# EAGLE design range_tag (EAGLE 8.2.2)
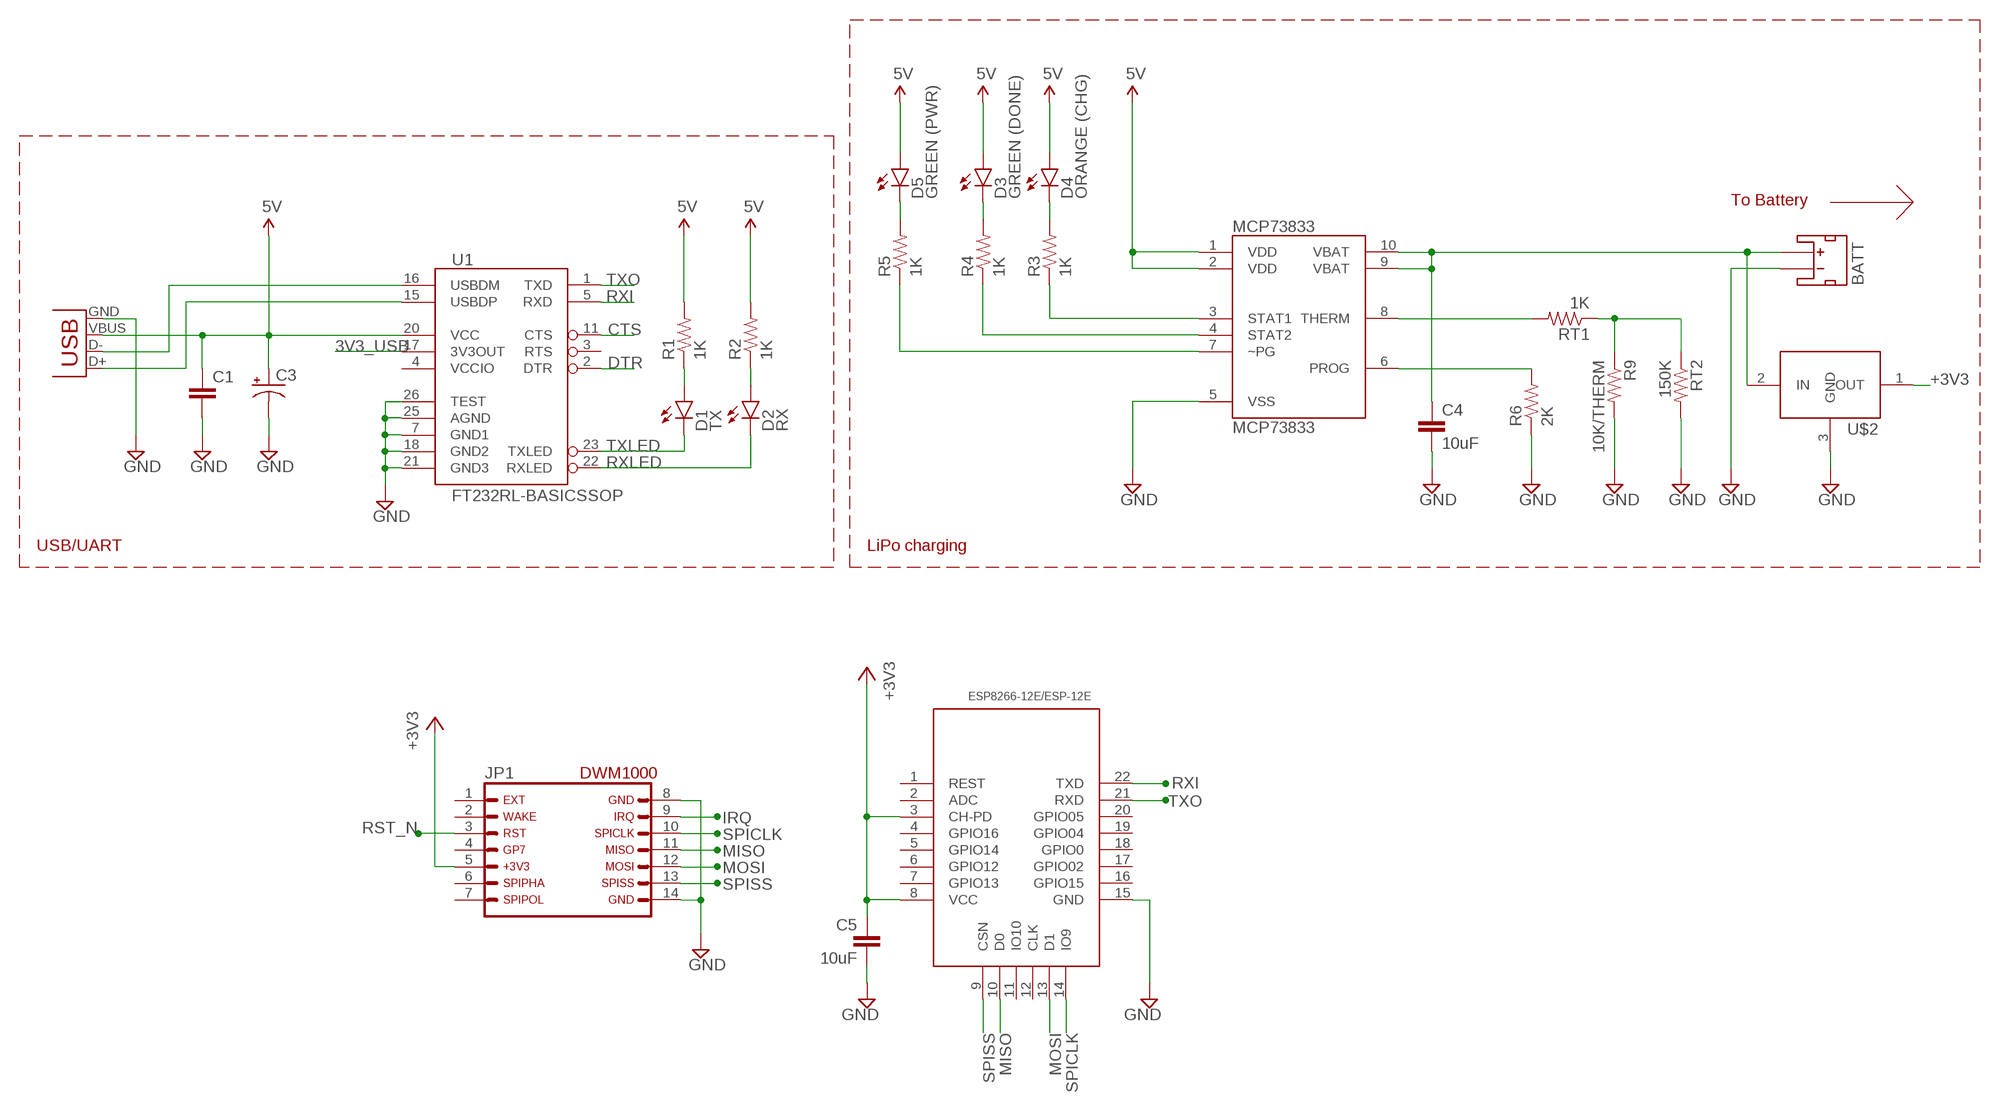
[diagram p0: schematic, sheet 1]

## Parts
BATT  JST_2MM_MALE  [JST-2-SMD]
C1  CAP0805  [0805]
C3  CAP_POL1206-KIT  [EIA3216-KIT]
C4  10uF  10UF-6.3V-20%(1206)  [1206]
C5  10uF  10UF-6.3V-20%(1206)  [1206]
D1  TX  LED-GREENLARGE  [LED-1206]
D2  RX  LED-GREENLARGE  [LED-1206]
D3  GREEN (DONE)  LED-GREENLARGE  [LED-1206]
D4  ORANGE (CHG)  LED-GREENLARGE  [LED-1206]
D5  GREEN (PWR)  LED-GREENLARGE  [LED-1206]
JP1  DWM1000-DIPDWM1000-BREAKOUT  [2X07_HOLES_ONLY]
JP2  USB-SMD-NS  [USB-MINIB-NOSTOP]
MCP73833  MCP73833  [MSOP-10]
R1  1K  RESISTOR1206  [1206]
R2  1K  RESISTOR1206  [1206]
R3  1K  RESISTOR1206  [1206]
R4  1K  RESISTOR1206  [1206]
R5  1K  RESISTOR1206  [1206]
R6  2K  RESISTOR1206  [1206]
R9  10K/THERM  RESISTOR1206  [1206]
RT1  1K  RESISTOR1206  [1206]
RT2  150K  RESISTOR1206  [1206]
U1  FT232RL-BASICSSOP  [SSOP28DB]
U3  ESP8266-12E/ESP-12E  MOUDLE-WIFI-ESP8266-12E/ESP-12E(22P-24X16MM)  [LGA22-2.0-24X16MM]
U$2  LM3480IM4  [SOT23-3]

## Nets
3V3_USB: U1.17(3V3OUT)
5V: C1.1 C3.A(+) D3.A D4.A D5.A JP2.VBUS MCP73833.1(VDD) MCP73833.2(VDD) R1.2 R2.2 U1.20(VCC)
+3V3: C5.1 JP1.5 U3.3(CH-PD) U3.8(VCC) U$2.1(OUT)
CTS: U1.11(CTS)
DTR: U1.2(DTR)
GND: BATT.1(-) C1.2 C3.C(-) C4.2 C5.2 JP1.8 JP1.14 JP2.GND MCP73833.5(VSS) R6.1 R9.2 RT2.2 U1.7(GND1) U1.18(GND2) U1.21(GND3) U1.25(AGND) U1.26(TEST) U3.15(GND) U$2.3(GND)
IRQ: JP1.9
MISO: JP1.11 U3.10(D0)
MOSI: JP1.12 U3.13(D1)
N$7: MCP73833.8(THERM) RT1.2
N$8: R9.1 RT1.1 RT2.1
N$9: D3.C R4.2
N$10: D4.C R3.2
N$11: D1.A R1.1
N$12: D2.A R2.1
N$14: D5.C R5.2
N$16: MCP73833.6(PROG) R6.2
N_PG: MCP73833.7(~PG) R5.1
RST_N: JP1.3
RXI: U1.5(RXD) U3.22(TXD)
RXLED: D2.C U1.22(RXLED)
SPICLK: JP1.10 U3.14(IO9)
SPISS: JP1.13 U3.9(CSN)
STAT1: MCP73833.3(STAT1) R3.1
STAT2: MCP73833.4(STAT2) R4.1
TXLED: D1.C U1.23(TXLED)
TXO: U1.1(TXD) U3.21(RXD)
USBDM: JP2.D- U1.16(USBDM)
USBDP: JP2.D+ U1.15(USBDP)
V_BATT: BATT.2(+) C4.1 MCP73833.9(VBAT) MCP73833.10(VBAT) U$2.2(IN)
Unconnected: BATT.NC1(PAD1) BATT.NC2(PAD2) JP1.1 JP1.2 JP1.4 JP1.6 JP1.7 U1.3(RTS) U3.1(REST) U3.2(ADC) U3.4(GPIO16) U3.5(GPIO14) U3.6(GPIO12) U3.7(GPIO13) U3.11(IO10) U3.12(CLK) U3.16(GPIO15) U3.17(GPIO02) U3.18(GPIO0) U3.19(GPIO04) U3.20(GPIO05)

## Notes on the sheet
- To Battery
- USB/UART | LiPo charging

## Power pins joined to a net without a drawn wire
VCCIO: U1.4(VCCIO)

## Library data of the parts
BATT = SparkFun-Connectors:JST_2MM_MALE: Mates to single-cell LiPo batteries. CONN-08352; PROD_ID: CONN-08352
C1 = SparkFun-Capacitors:CAP: Capacitor Standard 0603 ceramic capacitor, and 0.1" leaded capacitor.
C3 = SparkFun-Capacitors:CAP_POL: Capacitor Polarized These are standard SMD and PTH capacitors. Normally 10uF, 47uF, and 100uF in electrolytic and tantalum varieties. Always verify the external diameter of the through hole cap, it varies with capacity, voltage, and manufacturer. The EIA devices should be standard.
C4 C5 = SparkFun-Capacitors:10UF-6.3V-20%(1206): CAP-10057 Ceramic; PROD_ID: CAP-10057
D1-D5 = SparkFun-LED:LED-GREEN: Various green LEDs Green LEDs used in SFE Production 0603- DIO-00821 LARGE- DIO-00862 LILYPAD- DIO-09910; PROD_ID: DIO-00862; VALUE: GREEN
JP1 = custom:DWM1000-DIP: Header 7 Standard 7-pin 0.1" header. Use with straight break away headers (SKU : PRT-00116), right angle break away headers (PRT-00553), swiss pins (PRT-00743), machine pins (PRT-00117), and female headers (PRT-00115). NOTES ON THE VARIANTS LOCK and LOCK_LONGPADS... This footprint was designed to help hold the alignment of a through-hole component (i.e. 7-pin header) while soldering it into place. You may notice that each hole has been shifted either up or down by 0.005 of an inch from it's more standard position (which is usually a perfectly straight line). This slight alteration caused the pins (the squares in the middle) to touch the edges of the holes. Because they are alternating, it causes a "brace" to hold the header in place. 0.005 has proven to be the perfect amount of "off-center" position when using our standard breakaway headers. Although looks a little odd when you look at the bare footprint, once you have a header in there, the alteration is very hard to notice. Also, if you push a header all the way into place, it is covered up entirely on the bottom side. This idea of altering the position of holes to aid alignment will be further integrated into the Sparkfun Library for other footprints. It can help hold any component with 3 or more connection pins.
JP2 = SparkFun-Connectors:USB: USB Connectors USB-B-PTH is fully proven SKU : PRT-00139/CONN-08278 USB-miniB is fully proven SKU : PRT-00587 USB-A-PCB is untested. USB-A-H is throughly reviewed, but untested. Spark Fun Electronics SKU : PRT-00437 USB-B-SMT is throughly reviewed, but untested. Needs silkscreen touching up. USB-A-S has not been used/tested USB-MB-H has not been used/tested USB-MICROB has been used. CONN-09505
MCP73833 = SparkFun-PowerIC:MCP73833: Stand-alone Linear Li-ion/Li-polymer Charge Management Controller Packages: DFN-10, MSOP-10 Last modified: 8/17/10 Unproven!
R1-R6 R9 RT1 RT2 = SparkFun-Resistors:RESISTOR: Resistor Basic schematic elements and footprints for 0603, 1206, and PTH resistors.
U1 = SparkFun-DigitalIC:FT232RL-BASIC: USB UART This is the simplified version of the FT232RL unit. Only what you need, nothing you don't. Spark Fun Electronics SKU : COM-00650
U3 = Seeed-OPL-Moudle:MOUDLE-WIFI-ESP8266-12E/ESP-12E(22P-24X16MM): 317060015; MPN: ESP8266-12E/ESP-12E
U$2 = SparkFun-PowerIC:LM3480IM4: Small package linear regulator

## Board
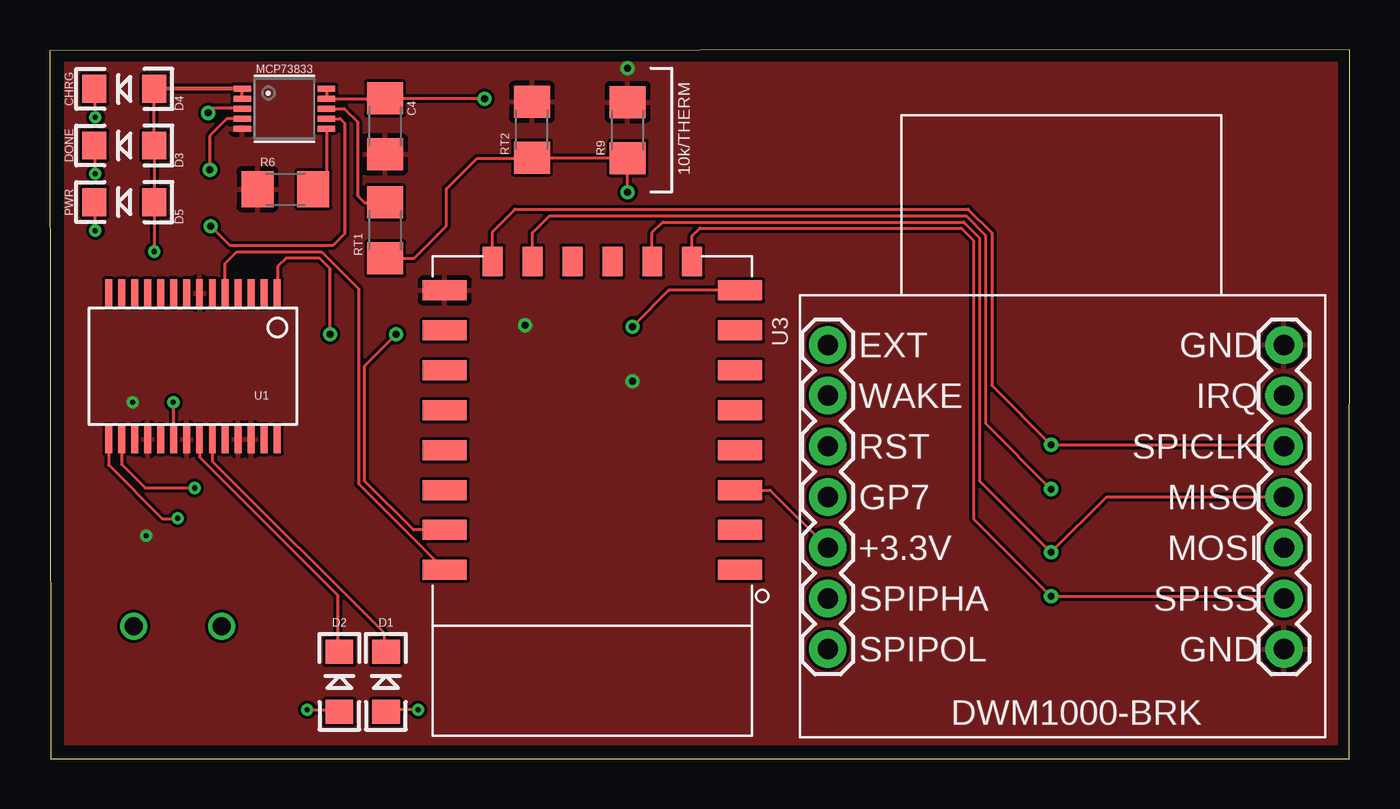
[diagram p1: board, top side]
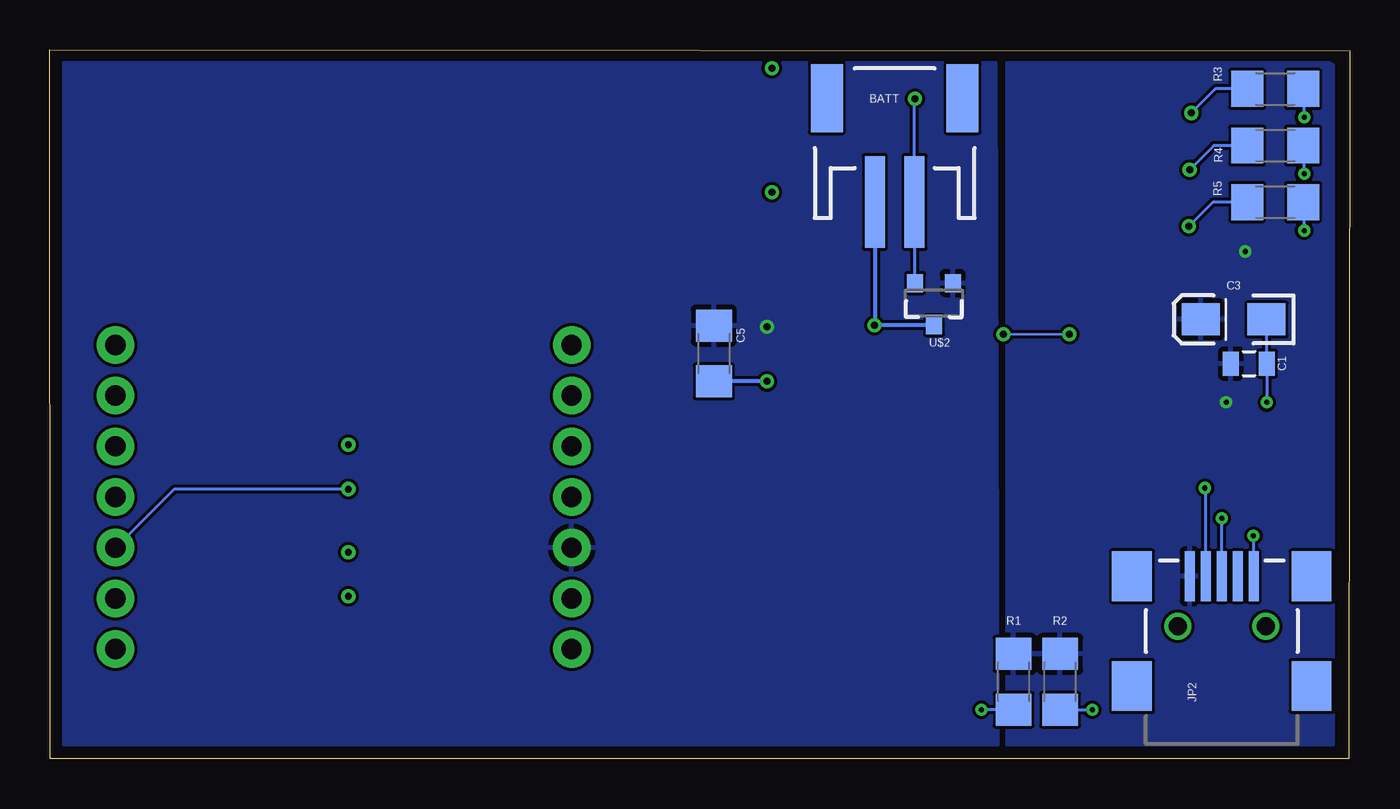
[diagram p2: board, bottom side, seen from below]

Size 65.14 x 35.52 mm. Coordinates in mm from the lower left corner, seen from the top.
Outline: 0.05,0.01 65.12,0 65.14,35.52 0,35.47 0.05,0.01
Copper layers (1*16): Top 0.0356mm / dielectric 1.5011mm / Bottom 0.0356mm
Design rules "oshpark-2layer *": minimum track width 6mil, minimum drill 10mil, track to track 6mil, track to pad 6mil, pad to pad 6mil, via to via 6mil, smd to smd 6mil, copper to edge 15mil, drill to drill 6mil, minimum pad ring 7mil, minimum via ring 7mil, stop-mask expansion 2.5mil, vias tented up to drill 0mil, thermal gap 10mil

### Footprints (pad centres in the part's own frame; a part is rotated, then mirrored left to right if it is on the bottom)
JST-2-SMD = smd 1 x 4.6: 1 -1,-3.7; 2 1,-3.7 | smd 1.6 x 3.4: NC1 -3.4,1.5; NC2 3.4,1.5
0805 = smd 0.8 x 1.2: 1 -0.9,0; 2 0.9,0
EIA3216-KIT = smd 1.9 x 1.6: A 1.65,0; C -1.65,0
1206 = smd 1.6 x 1.8: 1 -1.4,0; 2 1.4,0
LED-1206 = smd 1.2 x 1.4: A -1.5,0; C 1.5,0
2X07_HOLES_ONLY = drill 1.016 pad 1.88: 1 0,0; 2 2.54,0; 3 5.08,0; 4 7.62,0; 5 10.16,0; 6 12.7,0; 7 15.24,0; 8 0,22.86; 9 2.54,22.86; 10 5.08,22.86; 11 7.62,22.86; 12 10.16,22.86; 13 12.7,22.86; 14 15.24,22.86
USB-MINIB-NOSTOP = smd 2.5 x 0.5: D+ 2.5,0; D- 2.5,0.8; GND 2.5,-1.6; ID 2.5,-0.8; VBUS 2.5,1.6 | smd 2.5 x 2: G1 -3,-4.5; G2 -3,4.5; G3 2.5,4.5; G4 2.5,-4.5 | drill 0.9 pad 0.8: H1 0,2.2 | drill 0.9 pad 0.787: H2 0,-2.2
MSOP-10 = smd 0.305 x 0.889: 1 -1,-2.11; 2 -0.5,-2.11; 3 0,-2.11; 4 0.5,-2.11; 5 1,-2.11; 6 1,2.11; 7 0.5,2.11; 8 0,2.11; 9 -0.5,2.11; 10 -1,2.11
SSOP28DB = smd 0.348 x 1.397: 1 -4.225,-3.656; 2 -3.575,-3.656; 3 -2.925,-3.656; 4 -2.275,-3.656; 5 -1.625,-3.656; 6 -0.975,-3.656; 7 -0.325,-3.656; 8 0.325,-3.656; 9 0.975,-3.656; 10 1.625,-3.656; 11 2.275,-3.656; 12 2.925,-3.656; 13 3.575,-3.656; 14 4.225,-3.656; 15 4.225,3.656; 16 3.575,3.656; 17 2.925,3.656; 18 2.275,3.656; 19 1.625,3.656; 20 0.975,3.656; 21 0.325,3.656; 22 -0.325,3.656; 23 -0.975,3.656; 24 -1.625,3.656; 25 -2.275,3.656; 26 -2.925,3.656; 27 -3.575,3.656; 28 -4.225,3.656
LGA22-2.0-24X16MM = smd 2.2 x 1: 1 -7.4,3.7; 2 -7.4,1.7; 3 -7.4,-0.3; 4 -7.4,-2.3; 5 -7.4,-4.3; 6 -7.4,-6.3; 7 -7.4,-8.3; 8 -7.4,-10.3; 15 7.4,-10.3; 16 7.4,-8.3; 17 7.4,-6.3; 18 7.4,-4.3; 19 7.4,-2.3; 20 7.4,-0.3; 21 7.4,1.7; 22 7.4,3.7 | smd 1 x 1.5: 9 -5,-11.75; 10 -3,-11.75; 11 -1,-11.75; 12 1,-11.75; 13 3,-11.75; 14 5,-11.75
SOT23-3 = smd 0.8 x 0.9: 1 -0.95,-1; 2 0.95,-1; 3 0,1.1

### Placement (x,y rotation side)
BATT  22.8,31.6 0 bottom
C1  5.04,19.8 0 bottom
C3  5.82,22.02 180 bottom
C4  16.79,31.69 270 top
C5  31.86,20.31 270 bottom
D1  16.84,3.86 90 top
D2  14.51,3.86 90 top
D3  3.73,30.73 180 top
D4  3.73,33.57 180 top
D5  3.73,27.89 180 top
JP1  38.99,20.74 270 top
JP2  6.41,6.65 90 bottom
MCP73833  11.75,32.57 270 top
R1  16.84,3.86 90 bottom
R2  14.51,3.86 90 bottom
R3  3.73,33.57 0 bottom
R4  3.73,30.73 0 bottom
R5  3.73,27.89 0 bottom
R6  11.8,28.54 0 top
R9  28.96,31.5 90 top
RT1  16.81,26.48 90 top
RT2  24.16,31.52 90 top
U1  7.17,19.67 180 top
U3  27.19,13.17 180 top
U$2  20.83,22.83 180 bottom

### Tracks (layer width: path | path; a pad name or v marks a point on that pad's centre or on a via)
5V  (via drill 0.25)
  Top 0.152: MCP73833.2 MCP73833.1 | U1.20 v6.2,17.86 v6.19,17.86 | v5.22,25.42 v5.23,25.43 D5.A D3.A D4.A
  Top 0.2: MCP73833.1 D4.A
  pour Bottom: 1.02,34.87 17.21,34.87 17.21,0.71 0.79,0.71 0.79,34.76
+3V3  (via drill 0.35)
  Top 0.152: U3.3 36.1,13.47 JP1.5 | U3.8 31.01,23.47 v29.2,21.66
  pour Bottom: 17.7,34.87 64.48,34.87 64.48,0.71 17.6,0.71
GND  (via drill 0.25, 0.35)
  Bottom 0.152: C3.C 4.17,19.82 C1.2 v4.14,17.87 v4.15,17.86 | 20.86,21.7 U$2.3 | JP2.GND v4.81,11.17 v4.82,11.18
  Bottom 0.2: BATT.1 v23.8,21.74 v23.81,21.73 U$2.3 | v29.2,18.91 C5.2
  other vias: 28.96,34.61
  pour Top: 64.48,34.87 64.48,0.74 0.79,0.74 0.79,34.87
MISO  (via drill 0.35)
  Top 0.152: U3.10 30.19,26.38 30.7,26.89 45.8,26.89 46.59,26.11 46.59,14.43 46.59,14.35 46.59,13.94 v50.18,10.35 52.95,13.12 JP1.11
MOSI  (via drill 0.35)
  Top 0.152: U3.13 24.19,26.36 25.03,27.2 45.93,27.2 46.9,26.23 46.9,16.8 v50.18,13.52
  Bottom 0.152: v50.18,13.52 58.91,13.52 JP1.12
N$7
  Top 0.152: MCP73833.8 14.76,32.57 15.42,31.91 15.42,28.22 15.77,27.87 RT1.2
N$8  (via drill 0.35)
  Top 0.152: RT1.1 18.25,25.08 19.88,26.71 19.88,28.57 21.4,30.09 24.13,30.09 RT2.1 28.94,30.12 R9.1 v28.96,28.39
N$9  (via drill 0.25)
  Top 0.152: v2.28,29.31 2.28,30.68 D3.C
  Bottom 0.152: v2.28,29.31 2.28,30.68 R4.2
N$10  (via drill 0.25)
  Top 0.152: v2.28,32.14 2.28,33.52 D4.C
  Bottom 0.152: v2.28,32.14 2.28,33.52 R3.2
N$11  (via drill 0.25)
  Top 0.152: v18.45,2.46 16.94,2.46 D1.A
  Bottom 0.152: R1.1 v18.45,2.46
N$12  (via drill 0.25)
  Top 0.152: v12.9,2.46 14.41,2.46 D2.A
  Bottom 0.152: R2.1 v12.9,2.46
N$14  (via drill 0.25)
  Top 0.152: v2.28,26.47 2.28,27.84 D5.C
  Bottom 0.152: v2.28,26.47 2.28,27.84 R5.2
N$16
  Top 0.152: MCP73833.6 13.86,29.2 R6.2
N_PG  (via drill 0.35)
  Top 0.152: MCP73833.7 14.55,32.07 14.78,31.84 14.78,26.32 14.17,25.71 9.03,25.71 v8.06,26.68
  Bottom 0.152: R5.1 6.85,27.89 v8.06,26.68
RXI
  Top 0.152: U1.5 8.79,24.84 9.37,25.41 13.62,25.41 15.47,23.56 15.47,13.79 U3.22
RXLED
  Top 0.152: U1.22 7.5,15.12 14.42,8.19 14.42,5.45 D2.C
SPICLK  (via drill 0.35)
  Top 0.152: U3.14 22.19,26.42 23.31,27.54 46.02,27.54 47.2,26.36 47.2,18.71 v50.18,15.73 | 50.2,15.75 v50.18,15.73 | v50.18,15.73 61.78,15.73 JP1.10
SPISS  (via drill 0.35)
  Top 0.152: U3.9 32.19,26.2 32.58,26.59 45.67,26.59 46.29,25.98 46.29,12.03 v50.18,8.14 61.75,8.14 JP1.13
STAT1  (via drill 0.35)
  Top 0.152: MCP73833.3 9.63,32.59 8.17,32.59 v7.94,32.36
  Bottom 0.152: R3.1 6.73,33.57 v7.94,32.36
STAT2  (via drill 0.35)
  Top 0.152: MCP73833.4 8.87,32.07 8.01,31.21 v8.01,29.53 v8.02,29.52
  Bottom 0.152: R4.1 6.81,30.73 v8.02,29.52
TXLED
  Top 0.152: U1.23 8.14,14.91 16.74,6.31 16.74,5.46 D1.C
  Top 0.2: U1.23
TXO  (via drill 0.35)
  Top 0.152: U3.21 18.22,11.47 15.77,13.92 15.77,19.69 v17.36,21.27 | v14.05,21.27 14.05,24.55 13.51,25.09 11.84,25.09 11.42,24.67 11.42,23.35 U1.1
  Bottom 0.152: v14.05,21.27 v17.35,21.26 v17.36,21.27
USBDM  (via drill 0.25)
  Top 0.152: U1.16 3.6,14.76 4.77,13.58 v7.24,13.58 v7.25,13.57
  Bottom 0.152: 7.26,9.34 JP2.D- 7.21,13.53 v7.25,13.57
USBDP  (via drill 0.25)
  Top 0.152: U1.15 2.95,14.73 5.64,12.04 v6.4,12.04 v6.41,12.05
  Bottom 0.152: 6.43,9.35 JP2.D+ v6.41,12.05
V_BATT  (via drill 0.35)
  Top 0.152: MCP73833.10 MCP73833.9 16.1,33.07 C4.1 21.77,33.09 v21.79,33.07
  Bottom 0.152: v21.79,33.07 v21.8,33.06 BATT.2 21.78,27.88 U$2.2

### Text on the board
tPlace: CHRG | 10k/THERM | DONE | PWR